# Altium schematic sheet YYB2016_两节干电池.SchDoc
size A4
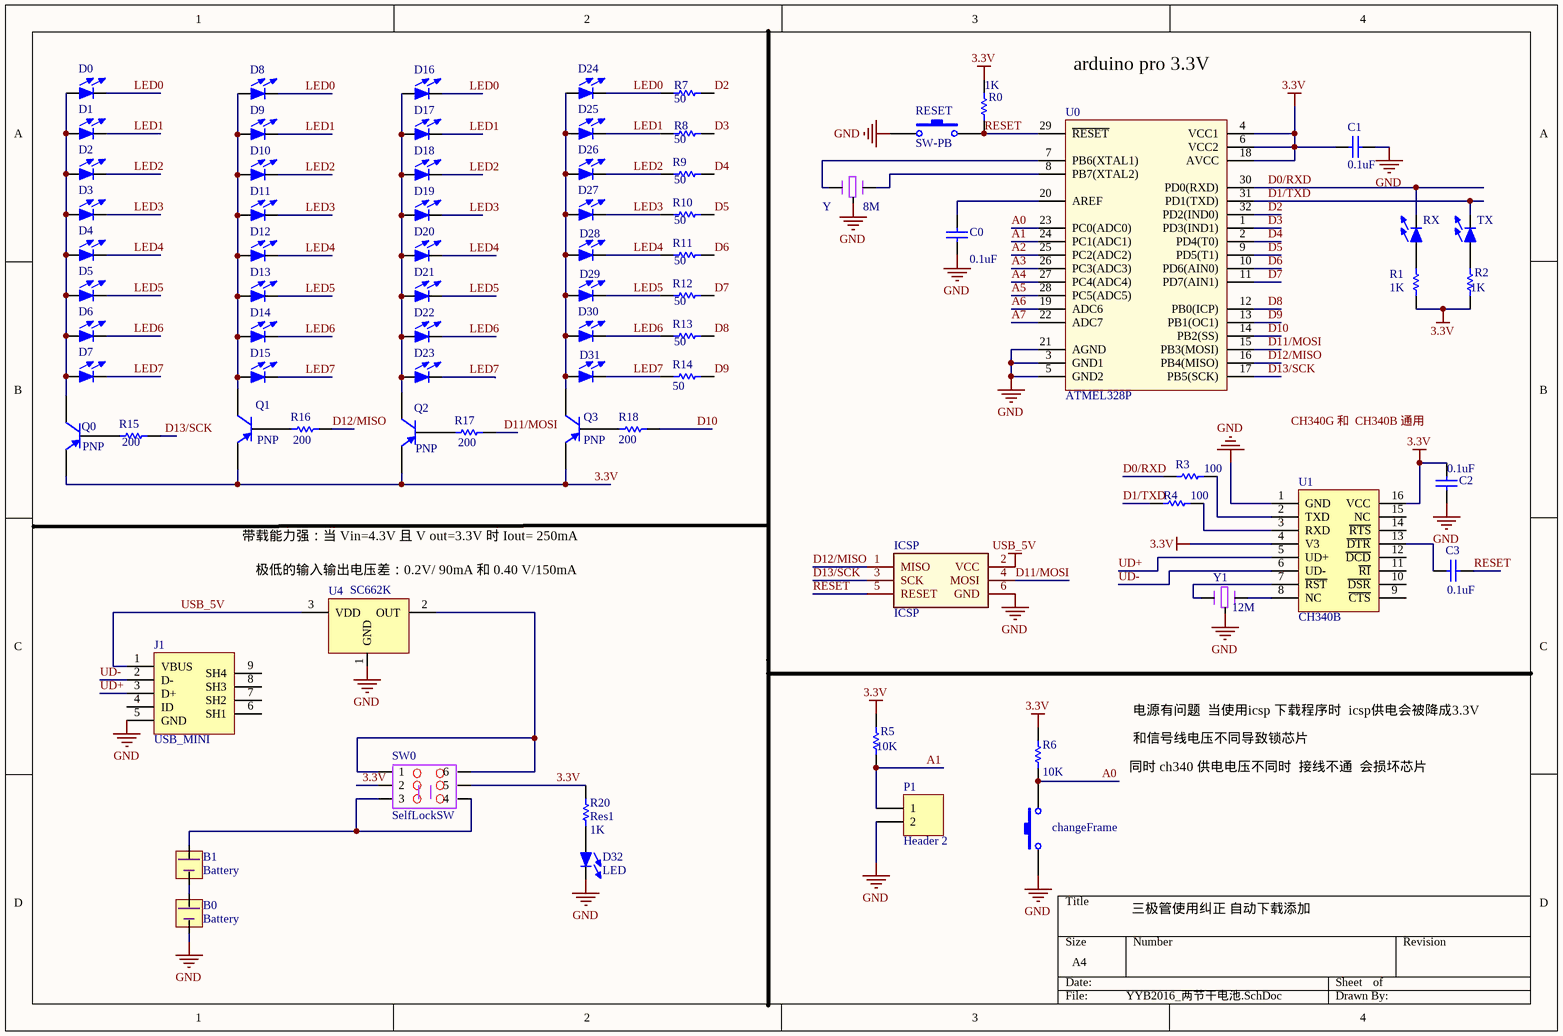
[diagram p0: YYB2016_两节干电池.SchDoc]

## Parts
B0  Battery  [BAT]
B1  Battery  [BAT]
C0  value 0.1uF  [6-0805_N]
C1  value 0.1uF  [6-0805_N]  (hidden comment: Cap)
C2  value 0.1uF  [6-0805_N]  (hidden comment: Cap)
C3  value 0.1uF  [6-0805_N]  (hidden comment: Cap)
changeFrame  SW-PB  [KEY_SODFL_2-Leads]  (value not drawn)
D0  (no value)  [LED_3528]
D1  (no value)  [LED_3528]
D2  (no value)  [LED_3528]
D3  (no value)  [LED_3528]
D4  (no value)  [LED_3528]
D5  (no value)  [LED_3528]
D6  (no value)  [LED_3528]
D7  (no value)  [LED_3528]
D8  (no value)  [LED_3528]
D9  (no value)  [LED_3528]
D10  (no value)  [LED_3528]
D11  (no value)  [LED_3528]
D12  (no value)  [LED_3528]
D13  (no value)  [LED_3528]
D14  (no value)  [LED_3528]
D15  (no value)  [LED_3528]
D16  (no value)  [LED_3528]
D17  (no value)  [LED_3528]
D18  (no value)  [LED_3528]
D19  (no value)  [LED_3528]
D20  (no value)  [LED_3528]
D21  (no value)  [LED_3528]
D22  (no value)  [LED_3528]
D23  (no value)  [LED_3528]
D24  (no value)  [LED_3528]
D25  (no value)  [LED_3528]
D26  (no value)  [LED_3528]
D27  (no value)  [LED_3528]
D28  (no value)  [LED_3528]
D29  (no value)  [LED_3528]
D30  (no value)  [LED_3528]
D31  (no value)  [LED_3528]
D32  LED  [LED_0805]
ICSP  ICSP  [HDR2X3]
J1  USB_MINI  [MICRO_USB]
P1  Header 2  [HDR1X2]
Q0  PNP  [PNP_SOT_23]
Q1  PNP  [PNP_SOT_23]
Q2  PNP  [PNP_SOT_23]
Q3  PNP  [PNP_SOT_23]
R0  value 1K  [6-0805_N]
R1  value 1K  [6-0805_N]  (hidden comment: Res1)
R2  value 1K  [6-0805_N]  (hidden comment: Res1)
R3  value 100  [6-0805_N]  (hidden comment: Res1)
R4  value 100  [6-0805_N]  (hidden comment: Res1)
R5  value 10K  [6-0805_N]  (hidden comment: Res1)
R6  value 10K  [6-0805_N]  (hidden comment: Res1)
R7  value 50  [6-0805_N]  (hidden comment: Res1)
R8  value 50  [6-0805_N]  (hidden comment: Res1)
R9  value 50  [6-0805_N]  (hidden comment: Res1)
R10  value 50  [6-0805_N]  (hidden comment: Res1)
R11  value 50  [6-0805_N]  (hidden comment: Res1)
R12  value 50  [6-0805_N]  (hidden comment: Res1)
R13  value 50  [6-0805_N]  (hidden comment: Res1)
R14  value 50  [6-0805_N]  (hidden comment: Res1)
R15  value 200  [6-0805_N]  (hidden comment: Res1)
R16  value 200  [6-0805_N]  (hidden comment: Res1)
R17  value 200  [6-0805_N]  (hidden comment: Res1)
R18  value 200  [6-0805_N]  (hidden comment: Res1)
R20  Res1  value 1K  [6-0805_N]
RESET  SW-PB  [KEY_SODFL_2-Leads]
RX  (no value)  [LED_0805]
SW0  SelfLockSW  [KEY_ZS_5.8*5.8]
TX  (no value)  [LED_0805]
U0  ATMEL328P  [TQFP 32]
U1  CH340B  [SOP16]
U4  SC662K  [SOT-23]
Y  8M  [XTAL]
Y1  12M  [XTAL]

## Nets
3.3V: C1.2 C2.2 Q0.2(E) Q1.2(E) Q2.2(E) Q3.2(E) R0.1 R1.1 R2.1 R5.2 R6.2 R20.2 SW0.2 SW0.5 U0.4(VCC1) U0.6(VCC2) U0.18(AVCC) U1.4(V3) U1.16(VCC)
GND: B0.2 C0.1 C1.1 C2.1 changeFrame.1 D32.2 ICSP.6(GND) J1.5(GND) P1.2 RESET.1 U0.3(GND1) U0.5(GND2) U0.21(AGND) U1.1(GND) U4.1(GND) Y.2 Y1.2
USB_5V: ICSP.2(VCC) J1.1(VBUS) U4.3(VDD)
A0: changeFrame.2 R6.1 U0.23(PC0(ADC0))
A1: P1.1 R5.1 U0.24(PC1(ADC1))
A2: U0.25(PC2(ADC2))
A3: U0.26(PC3(ADC3))
A4: U0.27(PC4(ADC4))
A5: U0.28(PC5(ADC5))
A6: U0.19(ADC6)
A7: U0.22(ADC7)
D0/RXD: R3.1 RX.2 U0.30(PD0(RXD))
D1/TXD: R4.1 TX.2 U0.31(PD1(TXD))
D2: R7.2 U0.32(PD2(IND0))
D3: R8.2 U0.1(PD3(IND1))
D4: R9.2 U0.2(PD4(T0))
D5: R10.2 U0.9(PD5(T1))
D6: R11.2 U0.10(PD6(AIN0))
D7: R12.2 U0.11(PD7(AIN1))
D8: R13.2 U0.12(PB0(ICP))
D9: R14.2 U0.13(PB1(OC1))
D10: R18.2 U0.14(PB2(SS))
D11/MOSI: ICSP.4(MOSI) R17.2 U0.15(PB3(MOSI))
D12/MISO: ICSP.1(MISO) R16.2 U0.16(PB4(MISO))
D13/SCK: ICSP.3(SCK) R15.2 U0.17(PB5(SCK))
LED0: D0.2 D8.2 D16.2 D24.2 R7.1
LED1: D1.2 D9.2 D17.2 D25.2 R8.1
LED2: D2.2 D10.2 D18.2 D26.2 R9.1
LED3: D3.2 D11.2 D19.2 D27.2 R10.1
LED4: D4.2 D12.2 D20.2 D28.2 R11.1
LED5: D5.2 D13.2 D21.2 D29.2 R12.1
LED6: D6.2 D14.2 D22.2 D30.2 R13.1
LED7: D7.2 D15.2 D23.2 D31.2 R14.1
RESET: C3.2 ICSP.5(RESET) R0.2 RESET.2 U0.29(~{RESET})
UD+: J1.3(D+) U1.5(UD+)
UD-: J1.2(D-) U1.6(UD-)
NetB0_1: B0.1(+) B1.2
NetB1_1: B1.1(+) SW0.3 SW0.4
NetC0_2: C0.2 U0.20(AREF)
NetC3_1: C3.1 U1.13(~{DTR})
NetD0_1: D0.1 D1.1 D2.1 D3.1 D4.1 D5.1 D6.1 D7.1 Q0.3(C)
NetD8_1: D8.1 D9.1 D10.1 D11.1 D12.1 D13.1 D14.1 D15.1 Q1.3(C)
NetD16_1: D16.1 D17.1 D18.1 D19.1 D20.1 D21.1 D22.1 D23.1 Q2.3(C)
NetD24_1: D24.1 D25.1 D26.1 D27.1 D28.1 D29.1 D30.1 D31.1 Q3.3(C)
NetD32_1: D32.1 R20.1
NetQ0_1: Q0.1(B) R15.1
NetQ1_1: Q1.1(B) R16.1
NetQ2_1: Q2.1(B) R17.1
NetQ3_1: Q3.1(B) R18.1
NetR1_2: R1.2 RX.1
NetR2_2: R2.2 TX.1
NetR3_2: R3.2 U1.2(TXD)
NetR4_2: R4.2 U1.3(RXD)
NetSW0_1: SW0.1 SW0.6 U4.2(OUT)
NetU0_7: U0.7(PB6(XTAL1)) Y.1
NetU0_8: U0.8(PB7(XTAL2)) Y.3
NetU1_7: U1.7(~{RST}) Y1.1
NetU1_8: U1.8(NC) Y1.3

Not connected (* = marked no-connect by the designer): J1 4(ID) 6(SH1) 7(SH2) 8(SH3) 9(SH4); U1 9(~{CTS}) 10(~{DSR}) 11(~{RI}) 12(~{DCD}) 14(~{RTS}) 15(NC)

## Notes on the sheet
- arduino pro 3.3V
- 带载能力强：当 Vin=4.3V 且 V out=3.3V 时 Iout= 250mA
- (near U4) 极低的输入输出电压差：0.2V/ 90mA 和 0.40 V/150mA
- 电源有问题  当使用icsp 下载程序时  icsp供电会被降成3.3V
- 同时 ch340 供电电压不同时  接线不通  会损坏芯片
- 和信号线电压不同导致锁芯片
- 三极管使用纠正 自动下载添加
- Labels drawn without touching a wire or pin: CH340G 和  CH340B 通用

## Library data of the parts
C0-C3 = Cap: Capacitor; Published: 8-Jun-2000; LatestRevisionDate: 17-Jul-2002; LatestRevisionNote: Re-released for DXP Platform.; PackageReference: RAD-0.3; Publisher: Altium Limited; PackageDescription: Radial Cap, Thru-Hole; 2 Leads; 0.3 in Pin Spacing
changeFrame RESET = SW-PB: Switch; Published: 24-Mar-1999; LatestRevisionDate: 17-Jul-2002; LatestRevisionNote: Re-released for DXP Platform.; PackageReference: SPST-2; Publisher: Altium Limited; PackageDescription: Switch; 2 Leads
D0-D31 RX TX = LED
P1 = Header 2: Header, 2-Pin; LatestRevisionDate: 17-Jul-2002; LatestRevisionNote: Re-released for DXP Platform.; Publisher: Altium Limited
Q0-Q3 = PNP: PNP Transistor; Published: 8-Jun-2000; LatestRevisionDate: 29-May-2009; LatestRevisionNote: IPC-7351 Footprint Added.; PackageVersion: Aug-1999; PackageReference: SOT-23B; Publisher: Altium Limited; PackageDescription: 3-Pin SOT-23 Package 0.95 mm Pitch, 2.4 mm Lead Span
R0-R18 R20 = Res1: Resistor; Published: 8-Jun-2000; LatestRevisionDate: 17-Jul-2002; LatestRevisionNote: Re-released for DXP Platform.; PackageReference: AXIAL-0.3; Publisher: Altium Limited; PackageDescription: Axial Device, Thru-Hole; 2 Leads; 0.3 in Pin Spacing
SW0 = SelfLockSwitch: 自锁开关
U0 = ATMEL-328P
U1 = CH340B: usb to uart
U4 = SC662k-3.3V: 3.3V 稳压芯片
Y Y1 = XTAL